# EAGLE schematic MCU board ATmega328p v2.1 (EAGLE 9.2.1)
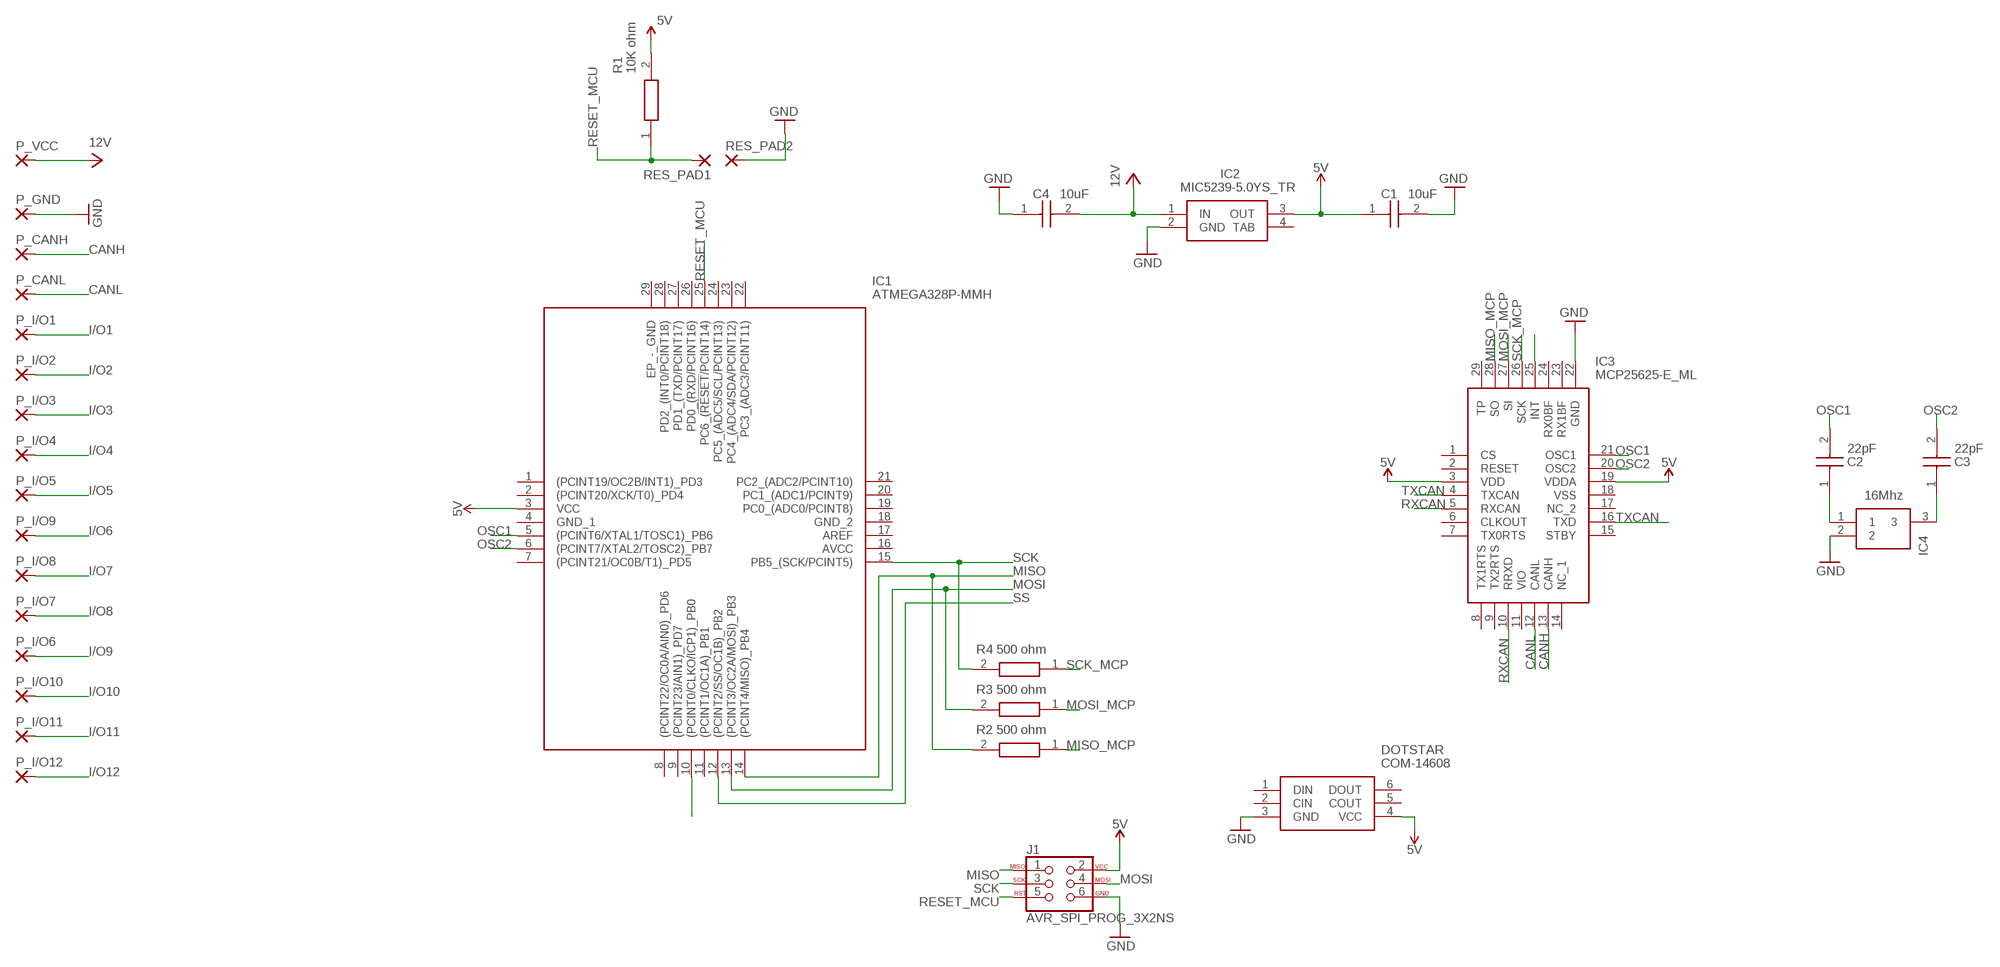
[diagram p0: schematic, sheet 1]

## Parts
C1  10uF  T491A106K016AT  [CAPPM3216X180N]
C2  22pF  12066D106KAT2A  [CAPC3216X229N]
C3  22pF  12066D106KAT2A  [CAPC3216X229N]
C4  10uF  T491A106K016AT  [CAPPM3216X180N]
DOTSTAR  COM-14608  [SON75P200X200X100-6N]
IC1  ATMEGA328P-MMH  [QFN45P400X400X100-29N]
IC2  MIC5239-5.0YS_TR  [SOT230P700X170-4N]
IC3  MCP25625-E_ML  [QFN65P600X600X100-29N]
IC4  16Mhz  CSTCE16M0V13C99-R0  [CSTCE16M0V13C99R0]
J1  AVR_SPI_PROG_3X2NS  [2X3-NS]
P_CANH  2,15/1,0  [2,15/1,0]
P_CANL  2,15/1,0  [2,15/1,0]
P_GND  2,15/1,0  [2,15/1,0]
P_I/O1  2,15/1,0  [2,15/1,0]
P_I/O2  2,15/1,0  [2,15/1,0]
P_I/O3  2,15/1,0  [2,15/1,0]
P_I/O4  2,15/1,0  [2,15/1,0]
P_I/O5  2,15/1,0  [2,15/1,0]
P_I/O6  2,15/1,0  [2,15/1,0]
P_I/O7  2,15/1,0  [2,15/1,0]
P_I/O8  2,15/1,0  [2,15/1,0]
P_I/O9  2,15/1,0  [2,15/1,0]
P_I/O10  2,15/1,0  [2,15/1,0]
P_I/O11  2,15/1,0  [2,15/1,0]
P_I/O12  2,15/1,0  [2,15/1,0]
P_VCC  2,15/1,0  [2,15/1,0]
R1  10K ohm  CPF0201D10KC1  [RESC0603X28N]
R2  500 ohm  CPF0201D10KC1  [RESC0603X28N]
R3  500 ohm  CPF0201D10KC1  [RESC0603X28N]
R4  500 ohm  CPF0201D10KC1  [RESC0603X28N]
RES_PAD1  SMD2  [SMD1,27-2,54]
RES_PAD2  SMD2  [SMD1,27-2,54]

## Nets
5V: C1.1(K) DOTSTAR.4(VCC) IC1.3(VCC) IC2.3(OUT) IC3.3(VDD) IC3.19(VDDA) J1.2 R1.2
CANH: IC3.13(CANH) P_CANH.1(P)
CANL: IC3.12(CANL) P_CANL.1(P)
GND: C1.2(A) C4.1(K) DOTSTAR.3(GND) IC2.2(GND) IC3.22(GND) IC4.2 J1.6 P_GND.1(P) RES_PAD2.1(P)
I/O1: P_I/O1.1(P)
I/O2: P_I/O2.1(P)
I/O3: P_I/O3.1(P)
I/O4: P_I/O4.1(P)
I/O5: P_I/O5.1(P)
I/O6: P_I/O9.1(P)
I/O7: P_I/O8.1(P)
I/O8: P_I/O7.1(P)
I/O9: P_I/O6.1(P)
I/O10: P_I/O10.1(P)
I/O11: P_I/O11.1(P)
I/O12: P_I/O12.1(P)
MISO: IC1.14((PCINT4/MISO)_PB4) J1.1 R2.2
MISO_MCP: IC3.28(SO) R2.1
MOSI: IC1.13((PCINT3/OC2A/MOSI)_PB3) J1.4 R3.2
MOSI_MCP: IC3.27(SI) R3.1
N$1: C2.1 IC4.1
N$2: C3.1 IC4.3
N$8: IC1.10((PCINT0/CLKO/ICP1)_PB0)
N$12: IC3.25(INT)
OSC1: C2.2 IC1.5((PCINT6/XTAL1/TOSC1)_PB6) IC3.21(OSC1)
OSC2: C3.2 IC1.6((PCINT7/XTAL2/TOSC2)_PB7) IC3.20(OSC2)
RESET_MCU: IC1.25(PC6_(!RESET!/PCINT14)) J1.5 R1.1 RES_PAD1.1(P)
RXCAN: IC3.5(RXCAN) IC3.10(RRXD)
SCK: IC1.15(PB5_(SCK/PCINT5)) J1.3 R4.2
SCK_MCP: IC3.26(SCK) R4.1
SS: IC1.12((PCINT2/SS/OC1B)_PB2)
TXCAN: IC3.4(TXCAN) IC3.16(TXD)
VCC: C4.2(A) IC2.1(IN) P_VCC.1(P) ; supply symbol labelled 12V
Unconnected: DOTSTAR.1(DIN) DOTSTAR.2(CIN) DOTSTAR.5(COUT) DOTSTAR.6(DOUT) IC1.1((PCINT19/OC2B/INT1)_PD3) IC1.2((PCINT20/XCK/T0)_PD4) IC1.4(GND_1) IC1.7((PCINT21/OC0B/T1)_PD5) IC1.8((PCINT22/OC0A/AIN0)_PD6) IC1.9((PCINT23/AIN1)_PD7) IC1.11((PCINT1/OC1A)_PB1) IC1.16(AVCC) IC1.17(AREF) IC1.18(GND_2) IC1.19(PC0_(ADC0/PCINT8)) IC1.20(PC1_(ADC1/PCINT9)) IC1.21(PC2_(ADC2/PCINT10)) IC1.22(PC3_(ADC3/PCINT11)) IC1.23(PC4_(ADC4/SDA/PCINT12)) IC1.24(PC5_(ADC5/SCL/PCINT13)) IC1.26(PD0_(RXD/PCINT16)) IC1.27(PD1_(TXD/PCINT17)) IC1.28(PD2_(INT0/PCINT18)) IC1.29(EP_-_GND) IC2.4(TAB) IC3.1(CS) IC3.2(RESET) IC3.6(CLKOUT) IC3.7(TX0RTS) IC3.8(TX1RTS) IC3.9(TX2RTS) IC3.11(VIO) IC3.14(NC_1) IC3.15(STBY) IC3.17(NC_2) IC3.23(RX1BF) IC3.24(RX0BF) IC3.29(TP)

## Power pins joined to a net without a drawn wire
VSS: IC3.18(VSS)

## Library data of the parts
C1 C4 = T491A106K016AT:T491A106K016AT: Capacitor Tantalum T491 Case A 16V 10uF Kemet ????10% 10????F 16 V dc SMD Tantalum Electrolytic Capacitor, A ESR 7???? +125????C T491 Source: Datasheet <http://www.kemet.com/Lists/ProductCatalog/Attachments/254/KEM_T2005_T491.pdf>; ARROW_PART_NUMBER: T491A106K016AT; ARROW_PRICE-STOCK: https://www.arrow.com/en/products/t491a106k016at/kemet-corporation; DESCRIPTION: Capacitor Tantalum T491 Case A 16V 10uF Kemet ????10% 10????F 16 V dc SMD Tantalum Electrolytic Capacitor, A ESR 7???? +125????C T491; HEIGHT: 1.8mm; MANUFACTURER_NAME: Kemet; MANUFACTURER_PART_NUMBER: T491A106K016AT; RS_PART_NUMBER: 1696687; RS_PRICE-STOCK: http://uk.rs-online.com/web/p/products/1696687
C2 C3 = 12066D106KAT2A:12066D106KAT2A: AVX 10uF /-10% 6.3 V dc X5R Dielectric SMD Ceramic Multilayer Capacitor 1206 Source: Datasheet <http://datasheets.avx.com/cx5r.pdf>; ALLIED_NUMBER: 70002294; ALLIED_PRICE-STOCK: http://www.alliedelec.com/avx-12066d106kat2a/70002294/; ARROW_PART_NUMBER: 12066D106KAT2A; ARROW_PRICE-STOCK: http://uk.rs-online.com/web/p/products/1356756; DESCRIPTION: AVX 10uF /-10% 6.3 V dc X5R Dielectric SMD Ceramic Multilayer Capacitor 1206; HEIGHT: 2.29mm; MANUFACTURER_NAME: AVX; MANUFACTURER_PART_NUMBER: 12066D106KAT2A; RS_PART_NUMBER: 1356756; RS_PRICE-STOCK: http://uk.rs-online.com/web/p/products/1356756
DOTSTAR = APA102–2020:COM-14608: SparkFun Accessories SMD LED - RGB APA102-2020 Source: Datasheet <https://componentsearchengine.com/Datasheets/1/COM-14608.pdf>; ARROW_PART_NUMBER: COM-14608; DESCRIPTION: SparkFun Accessories SMD LED - RGB APA102-2020; HEIGHT: 1mm; MANUFACTURER_NAME: SparkFun; MANUFACTURER_PART_NUMBER: COM-14608
IC1 = ATMEGA328P-MMH:ATMEGA328P-MMH: Atmel ATMEGA328P-MMH, 8bit AVR Microcontroller, 20MHz, 32 kB Flash, 28-Pin QFN Source: Datasheet <http://uk.rs-online.com/web/p/products/8149138P>; ARROW_PART_NUMBER: ATMEGA328P-MMH; ARROW_PRICE-STOCK: https://www.arrow.com/en/products/atmega328p-mmh/microchip-technology; DESCRIPTION: Atmel ATMEGA328P-MMH, 8bit AVR Microcontroller, 20MHz, 32 kB Flash, 28-Pin QFN; HEIGHT: 1mm; MANUFACTURER_NAME: Microchip; MANUFACTURER_PART_NUMBER: ATMEGA328P-MMH; RS_PART_NUMBER: 1310272P; RS_PRICE-STOCK: http://uk.rs-online.com/web/p/products/1310272P
IC2 = MIC5239-5.0YS_TR:MIC5239-5.0YS_TR: LDO Regulator Pos 5V 0.5A Micrel MIC5239-5.0YS TR, LDO Voltage Regulator, 500mA, 5 V 1%, 2.3 30 Vin, 3 + Tab-Pin SOT-223 Source: Datasheet <http://ww1.microchip.com/downloads/en/DeviceDoc/mic5239.pdf>; ARROW_PART_NUMBER: MIC5239-5.0YS TR; ARROW_PRICE-STOCK: http://uk.rs-online.com/web/p/products/7275535P; DESCRIPTION: LDO Regulator Pos 5V 0.5A Micrel MIC5239-5.0YS TR, LDO Voltage Regulator, 500mA, 5 V 1%, 2.3 30 Vin, 3 + Tab-Pin SOT-223; HEIGHT: 1.7mm; MANUFACTURER_NAME: Micrel; MANUFACTURER_PART_NUMBER: MIC5239-5.0YS TR; RS_PART_NUMBER: 7275535P; RS_PRICE-STOCK: http://uk.rs-online.com/web/p/products/7275535P
IC3 = MCP25625-E_ML:MCP25625-E_ML: CAN Controller with Transceiver QFN28 Microchip MCP25625-E/ML, CAN Controller, 28-Pin QFN Source: Datasheet <http://docs-europe.electrocomponents.com/webdocs/137c/0900766b8137cddf.pdf>; ALLIED_NUMBER: 70431541; ALLIED_PRICE-STOCK: http://www.alliedelec.com/microchip-technology-inc-mcp25625-e-ml/70431541/; ARROW_PART_NUMBER: MCP25625-E/ML; ARROW_PRICE-STOCK: https://www.arrow.com/en/products/mcp25625-eml/microchip-technology; DESCRIPTION: CAN Controller with Transceiver QFN28 Microchip MCP25625-E/ML, CAN Controller, 28-Pin QFN; HEIGHT: 1mm; MANUFACTURER_NAME: Microchip; MANUFACTURER_PART_NUMBER: MCP25625-E/ML; RS_PART_NUMBER: 1654104; RS_PRICE-STOCK: http://uk.rs-online.com/web/p/products/1654104
IC4 = CSTCE16M0V13C99-R0:CSTCE16M0V13C99-R0: SMD Ceramic Resonator 16 MHz 15PF CSTCE16M0V13C99-R0, Ceramic Resonator, 16MHz Expander 15pF, 4-Pin, 3.2 x 1.3 x 0.9mm Source: Datasheet <https://www.murata.com/en-sg/api/pdfdownloadapi?cate=&partno=CSTCE16M0V13C99-R0>; ARROW_PART_NUMBER: CSTCE16M0V13C99-R0; ARROW_PRICE-STOCK: https://www.arrow.com/en/products/cstce16m0v13c99-r0/murata-manufacturing; DESCRIPTION: SMD Ceramic Resonator 16 MHz 15PF CSTCE16M0V13C99-R0, Ceramic Resonator, 16MHz Expander 15pF, 4-Pin, 3.2 x 1.3 x 0.9mm; HEIGHT: 1mm; MANUFACTURER_NAME: Murata Electronics; MANUFACTURER_PART_NUMBER: CSTCE16M0V13C99-R0; RS_PART_NUMBER: 1669513; RS_PRICE-STOCK: http://uk.rs-online.com/web/p/products/1669513
J1 = SparkFun-Connectors:AVR_SPI_PROG_3X2: AVR ISP 6 Pin This is the reduced ISP connector for AVR programming. Common on Arduino. This footprint will take up less PCB space and can be used with a 10-pin to 6-pin adapter such as SKU: BOB-08508 **Special note about "TEST_POINT" package. The stop mask is on the top side, so if you want your programming test points to be on the bottom of your board, make sure to place this package on the bottom side of the board. This also ensure that the orientation to program from the bottom side will be correct. SparkFun Products: SparkFun ISP Pogo Adapter <https://www.sparkfun.com/products/11591> - NS Tiny AVR Programmer <https://www.sparkfun.com/products/11801> -PTH
P_CANH P_CANL P_GND P_I/O1-P_I/O12 P_VCC = wirepad:2,15/1,0: THROUGH-HOLE PAD
R1-R4 = CPF0201D10KC1:CPF0201D10KC1: TE Connectivity CPF Series Thin Film Surface Mount Fixed Resistor 0201 Case 10k 0.5% 0.031W 50ppm/C Source: Datasheet <http://www.te.com/commerce/DocumentDelivery/DDEController?Action=showdoc&DocId=Data Sheet1773200-1ApdfEnglishENG_DS_1773200-1_A.pdf4-2176215-6>; ARROW_PART_NUMBER: CPF0201D10KC1; ARROW_PRICE-STOCK: http://uk.rs-online.com/web/p/products/7549833; DESCRIPTION: TE Connectivity CPF Series Thin Film Surface Mount Fixed Resistor 0201 Case 10k 0.5% 0.031W 50ppm/C; HEIGHT: 0.28mm; MANUFACTURER_NAME: TE Connectivity; MANUFACTURER_PART_NUMBER: CPF0201D10KC1; RS_PART_NUMBER: 7549833; RS_PRICE-STOCK: http://uk.rs-online.com/web/p/products/7549833
RES_PAD1 RES_PAD2 = wirepad:SMD2: SMD PAD